# Altium schematic sheet Camera 5-6.SchDoc
size A; DrawnBy: Nick D'Ademo; DocumentNumber: 4; Revision: A; SheetNumber: 4; SheetTotal: 11
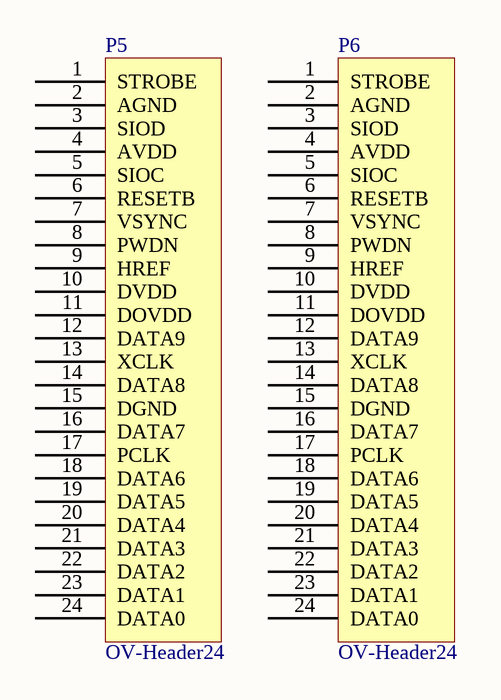
[diagram p0: Camera 5-6.SchDoc]

## Parts
P5  OV-Header24  [2-1734592-4_REVERSED]
P6  OV-Header24  [2-1734592-4_REVERSED]

## Nets

Not connected (* = marked no-connect by the designer): P5 1(STROBE) 2(AGND) 3(SIOD) 4(AVDD) 5(SIOC) 6(RESETB) 7(VSYNC) 8(PWDN) 9(HREF) 10(DVDD) 11(DOVDD) 12(DATA9) 13(XCLK) 14(DATA8) 15(DGND) 16(DATA7) 17(PCLK) 18(DATA6) 19(DATA5) 20(DATA4) 21(DATA3) 22(DATA2) 23(DATA1) 24(DATA0); P6 1(STROBE) 2(AGND) 3(SIOD) 4(AVDD) 5(SIOC) 6(RESETB) 7(VSYNC) 8(PWDN) 9(HREF) 10(DVDD) 11(DOVDD) 12(DATA9) 13(XCLK) 14(DATA8) 15(DGND) 16(DATA7) 17(PCLK) 18(DATA6) 19(DATA5) 20(DATA4) 21(DATA3) 22(DATA2) 23(DATA1) 24(DATA0)

## Library data of the parts
P5 P6 = OV-Header24: TE CONNECTIVITY - 2-1734592-4 - CONN FPC BOTTOM 24POS 0.50MM R/A